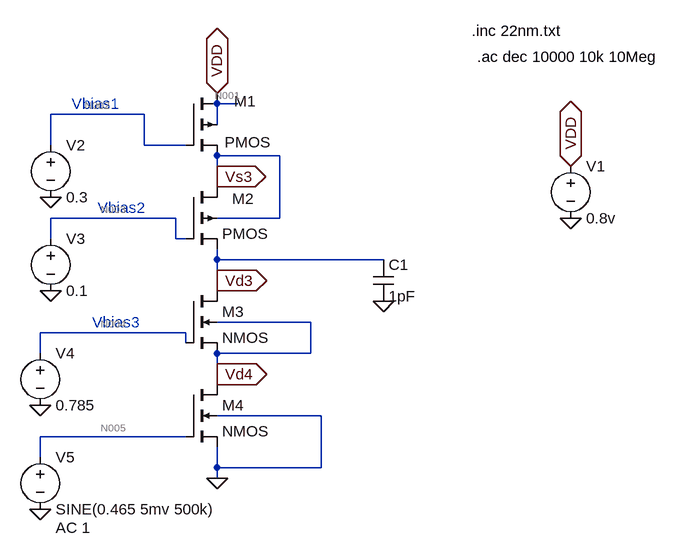
[diagram p0: schematic Cascode_amplifier.asc]
Cascode_amplifier.asc, the LTspice schematic file:
Version 4
SHEET 1 880 956
WIRE 32 96 16 96
WIRE 64 96 32 96
WIRE -80 112 -224 112
WIRE 32 128 32 96
WIRE -224 160 -224 112
WIRE -80 160 -80 112
WIRE -16 160 -80 160
WIRE 128 176 32 176
WIRE 32 208 32 176
WIRE 32 224 32 208
WIRE -32 272 -224 272
WIRE 128 272 128 176
WIRE 128 272 32 272
WIRE -224 304 -224 272
WIRE -32 304 -32 272
WIRE -16 304 -32 304
WIRE 32 336 32 320
WIRE 288 336 32 336
WIRE 32 368 32 336
WIRE 32 384 32 368
WIRE 176 432 32 432
WIRE -16 448 -240 448
WIRE -16 464 -16 448
WIRE -240 480 -240 448
WIRE 176 480 176 432
WIRE 176 480 32 480
WIRE 32 512 32 480
WIRE 32 528 32 512
WIRE 192 576 32 576
WIRE -16 608 -240 608
WIRE -240 640 -240 608
WIRE 32 656 32 624
WIRE 192 656 192 576
WIRE 192 656 32 656
WIRE 32 672 32 656
FLAG 576 272 0
FLAG 576 192 VDD
IOPIN 576 192 BiDir
FLAG 32 80 VDD
IOPIN 32 80 BiDir
FLAG -224 240 0
FLAG -224 384 0
FLAG -240 560 0
FLAG -240 720 0
FLAG 32 512 Vd4
IOPIN 32 512 Out
FLAG 32 368 Vd3
IOPIN 32 368 Out
FLAG 32 208 Vs3
IOPIN 32 208 Out
FLAG 288 400 0
FLAG 32 672 0
SYMBOL pmos4 -16 80 R0
WINDOW 0 74 12 Left 2
WINDOW 3 60 75 Left 2
SYMATTR InstName M1
SYMATTR Value2 l=44n w=819n
SYMBOL pmos4 -16 224 R0
WINDOW 0 71 18 Left 2
SYMATTR InstName M2
SYMATTR Value2 l=44n w=819n
SYMBOL nmos4 -16 384 R0
SYMATTR InstName M3
SYMATTR Value2 l=44n w=820.52n
SYMBOL voltage 576 176 R0
WINDOW 123 0 0 Left 0
WINDOW 39 0 0 Left 0
SYMATTR InstName V1
SYMATTR Value 0.8v
SYMBOL voltage -224 144 R0
WINDOW 123 0 0 Left 0
WINDOW 39 0 0 Left 0
SYMATTR InstName V2
SYMATTR Value 0.3
SYMBOL voltage -224 288 R0
WINDOW 123 0 0 Left 0
WINDOW 39 0 0 Left 0
SYMATTR InstName V3
SYMATTR Value 0.1
SYMBOL voltage -240 464 R0
WINDOW 123 0 0 Left 0
WINDOW 39 0 0 Left 0
SYMATTR InstName V4
SYMATTR Value 0.785
SYMBOL voltage -240 624 R0
WINDOW 123 24 124 Left 2
WINDOW 39 0 0 Left 0
SYMATTR Value2 AC 1
SYMATTR InstName V5
SYMATTR Value SINE(0.465 5mv 500k)
SYMBOL cap 272 336 R0
SYMATTR InstName C1
SYMATTR Value 1pF
SYMBOL nmos4 -16 528 R0
SYMATTR InstName M4
SYMATTR Value2 l=44n w=820.52n
TEXT 424 -16 Left 2 !.inc 22nm.txt
TEXT 432 24 Left 2 !.ac dec 10000 10k 10Meg
TEXT -192 96 Left 2 ;Vbias1
TEXT -152 256 Left 2 ;Vbias2
TEXT -160 432 Left 2 ;Vbias3

The netlist it stands for:
* Cascode_amplifier.asc
M1 VDD N002 Vs3 N001 PMOS l=44n w=819n
M2 Vs3 N003 Vd3 Vs3 PMOS l=44n w=819n
M3 Vd3 N004 Vd4 Vd4 NMOS l=44n w=820.52n
V1 VDD 0 0.8v
V2 N002 0 0.3
V3 N003 0 0.1
V4 N004 0 0.785
V5 N005 0 SINE(0.465 5mv 500k) AC 1
C1 Vd3 0 1pF
M4 Vd4 N005 0 0 NMOS l=44n w=820.52n
.model NMOS NMOS
.model PMOS PMOS
.lib standard.mos
.inc 22nm.txt
.ac dec 10000 10k 10Meg
* Vbias1
* Vbias2
* Vbias3
.backanno
.end

* Results of the author's LTspice run, read from the files saved beside the schematic
* Operating Point, zero values left out:
*   V(vdd) = 800 mV
*   V(n002) = 300 mV
*   V(vs3) = 641.5 mV
*   V(n001) = 689.6 mV
*   V(n003) = 100 mV
*   V(vd3) = 564.4 mV
*   V(n004) = 785 mV
*   V(vd4) = 318.2 mV
*   V(n005) = 465 mV
*   Id(M1) = 9.25 µA
*   Is(M1) = -9.25 µA
*   Id(M2) = 9.25 µA
*   Is(M2) = -9.25 µA
*   Id(M3) = 9.25 µA
*   Ig(M3) = 15.42 pA
*   Is(M3) = -9.25 µA
*   Id(M4) = 9.25 µA
*   Ig(M4) = 14.51 pA
*   Is(M4) = -9.25 µA
*   I(V1) = -9.25 µA
*   I(V4) = -15.42 pA
*   I(V5) = -14.51 pA